# Altium schematic sheet ZynQ7xxx.SchDoc
size A1
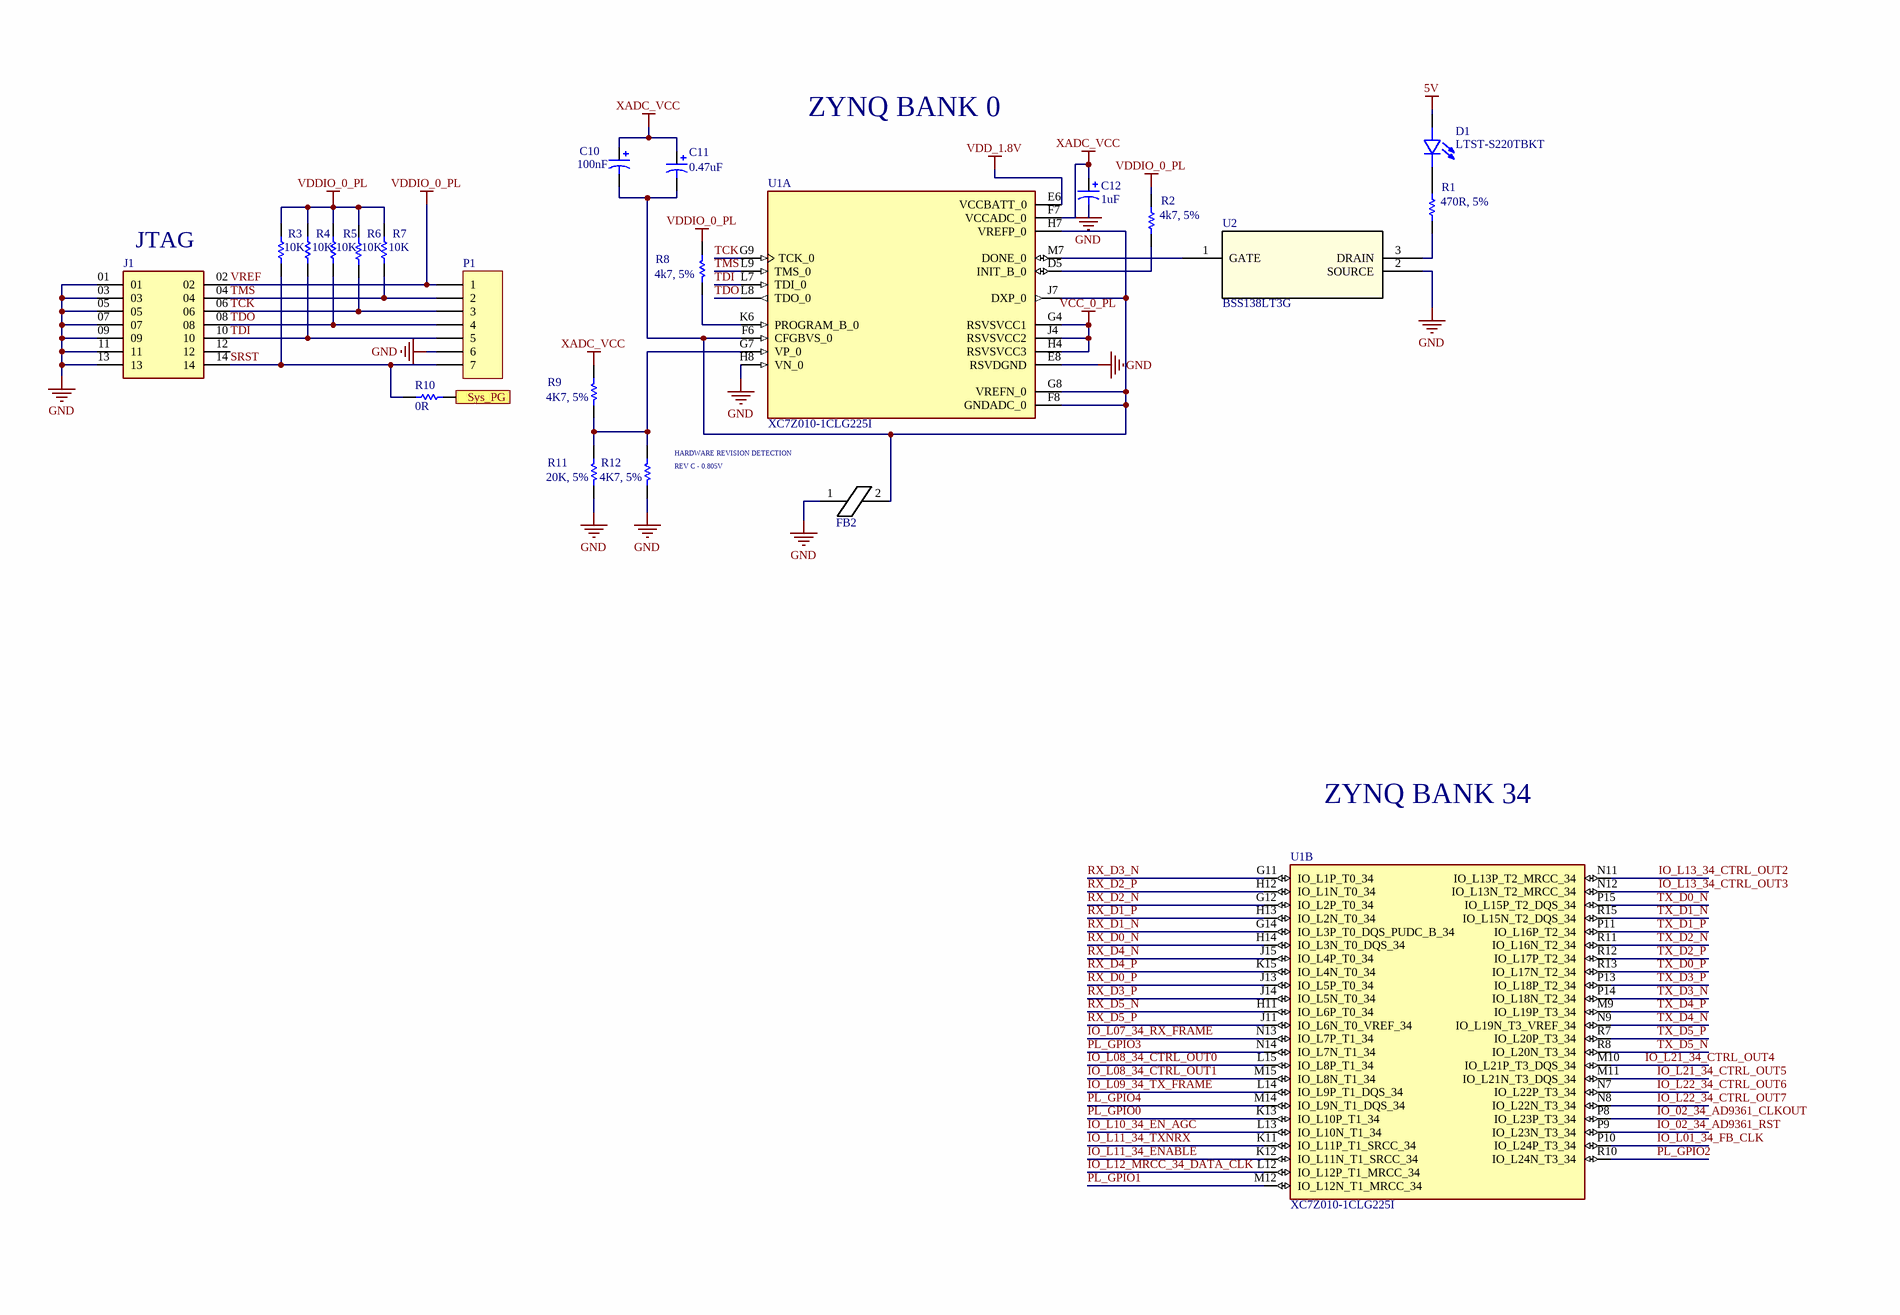
[diagram p0: ZynQ7xxx.SchDoc, top left]
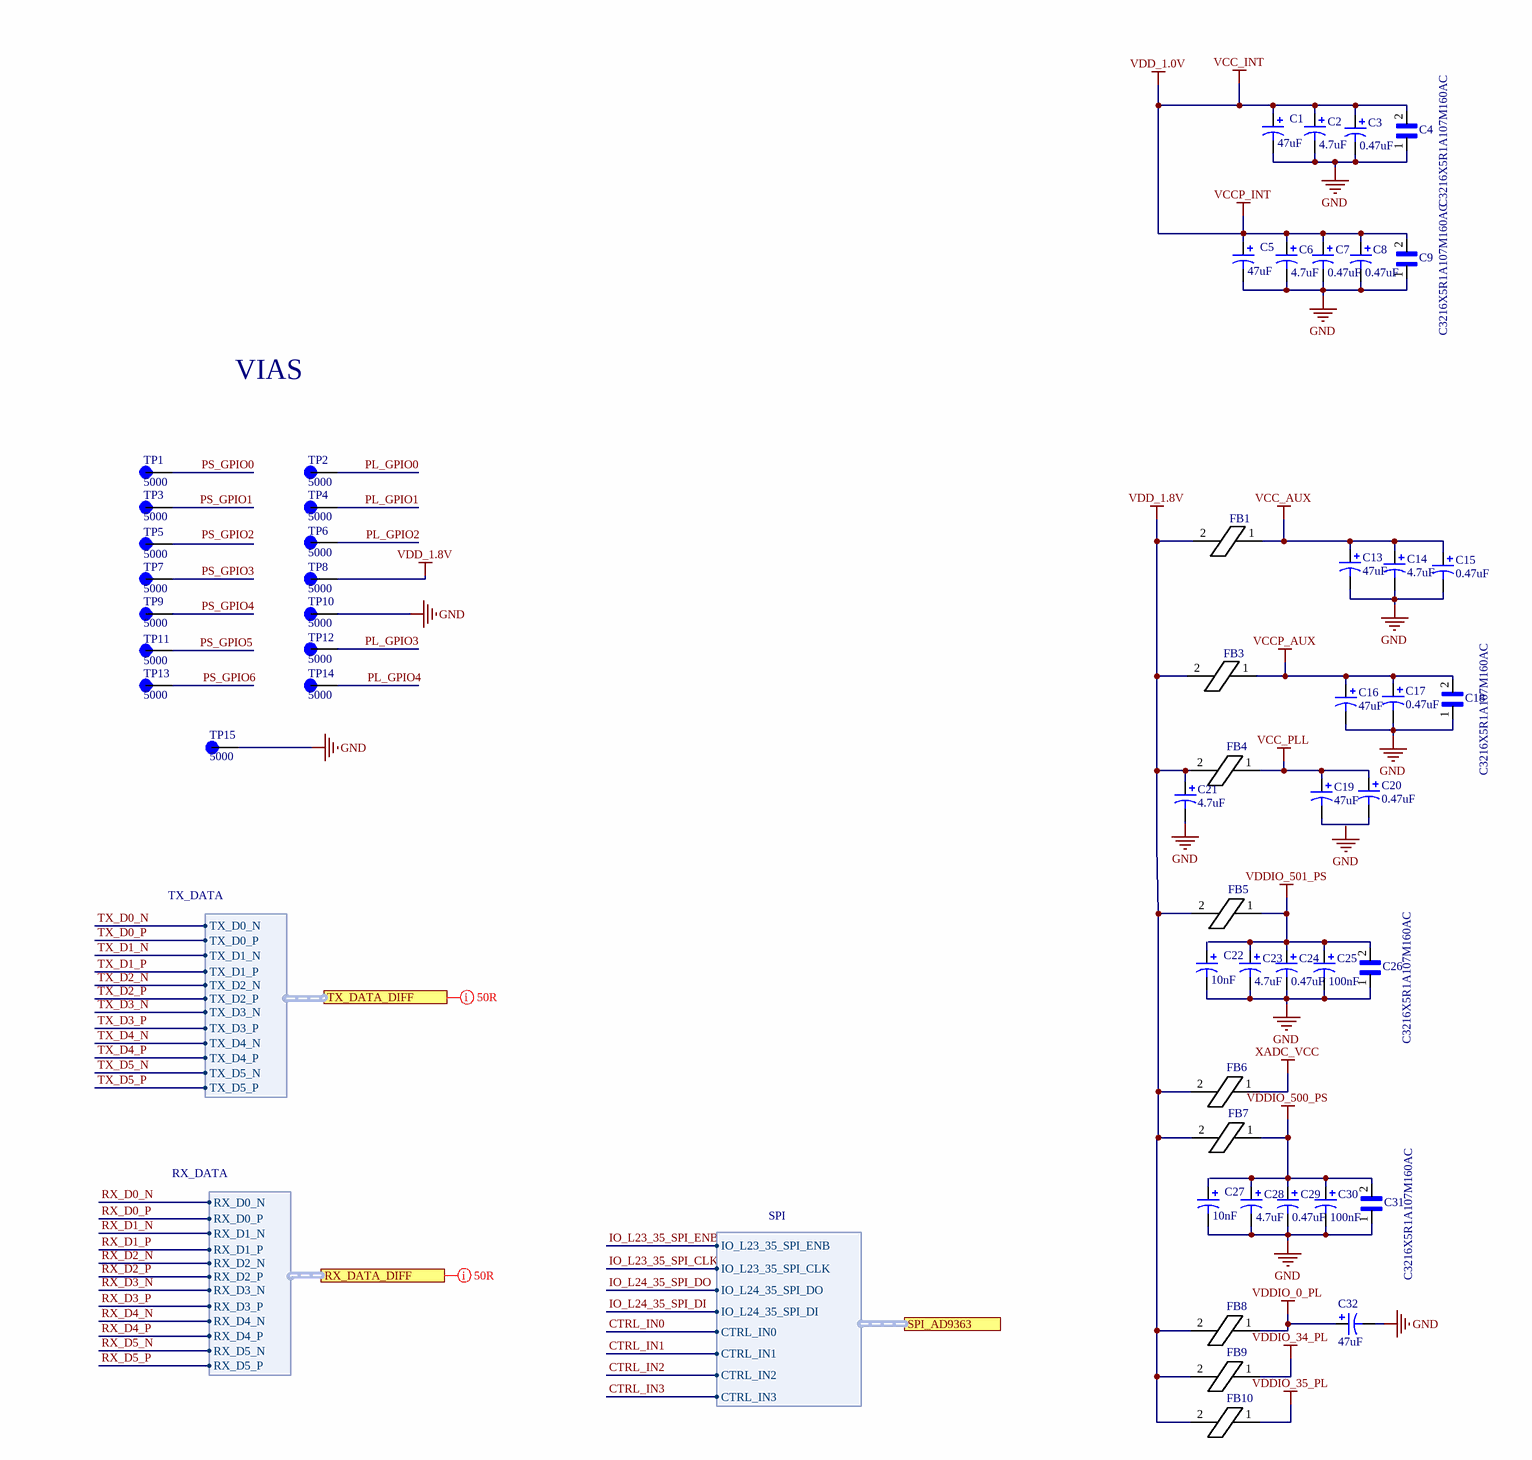
[diagram p1: ZynQ7xxx.SchDoc, top right]
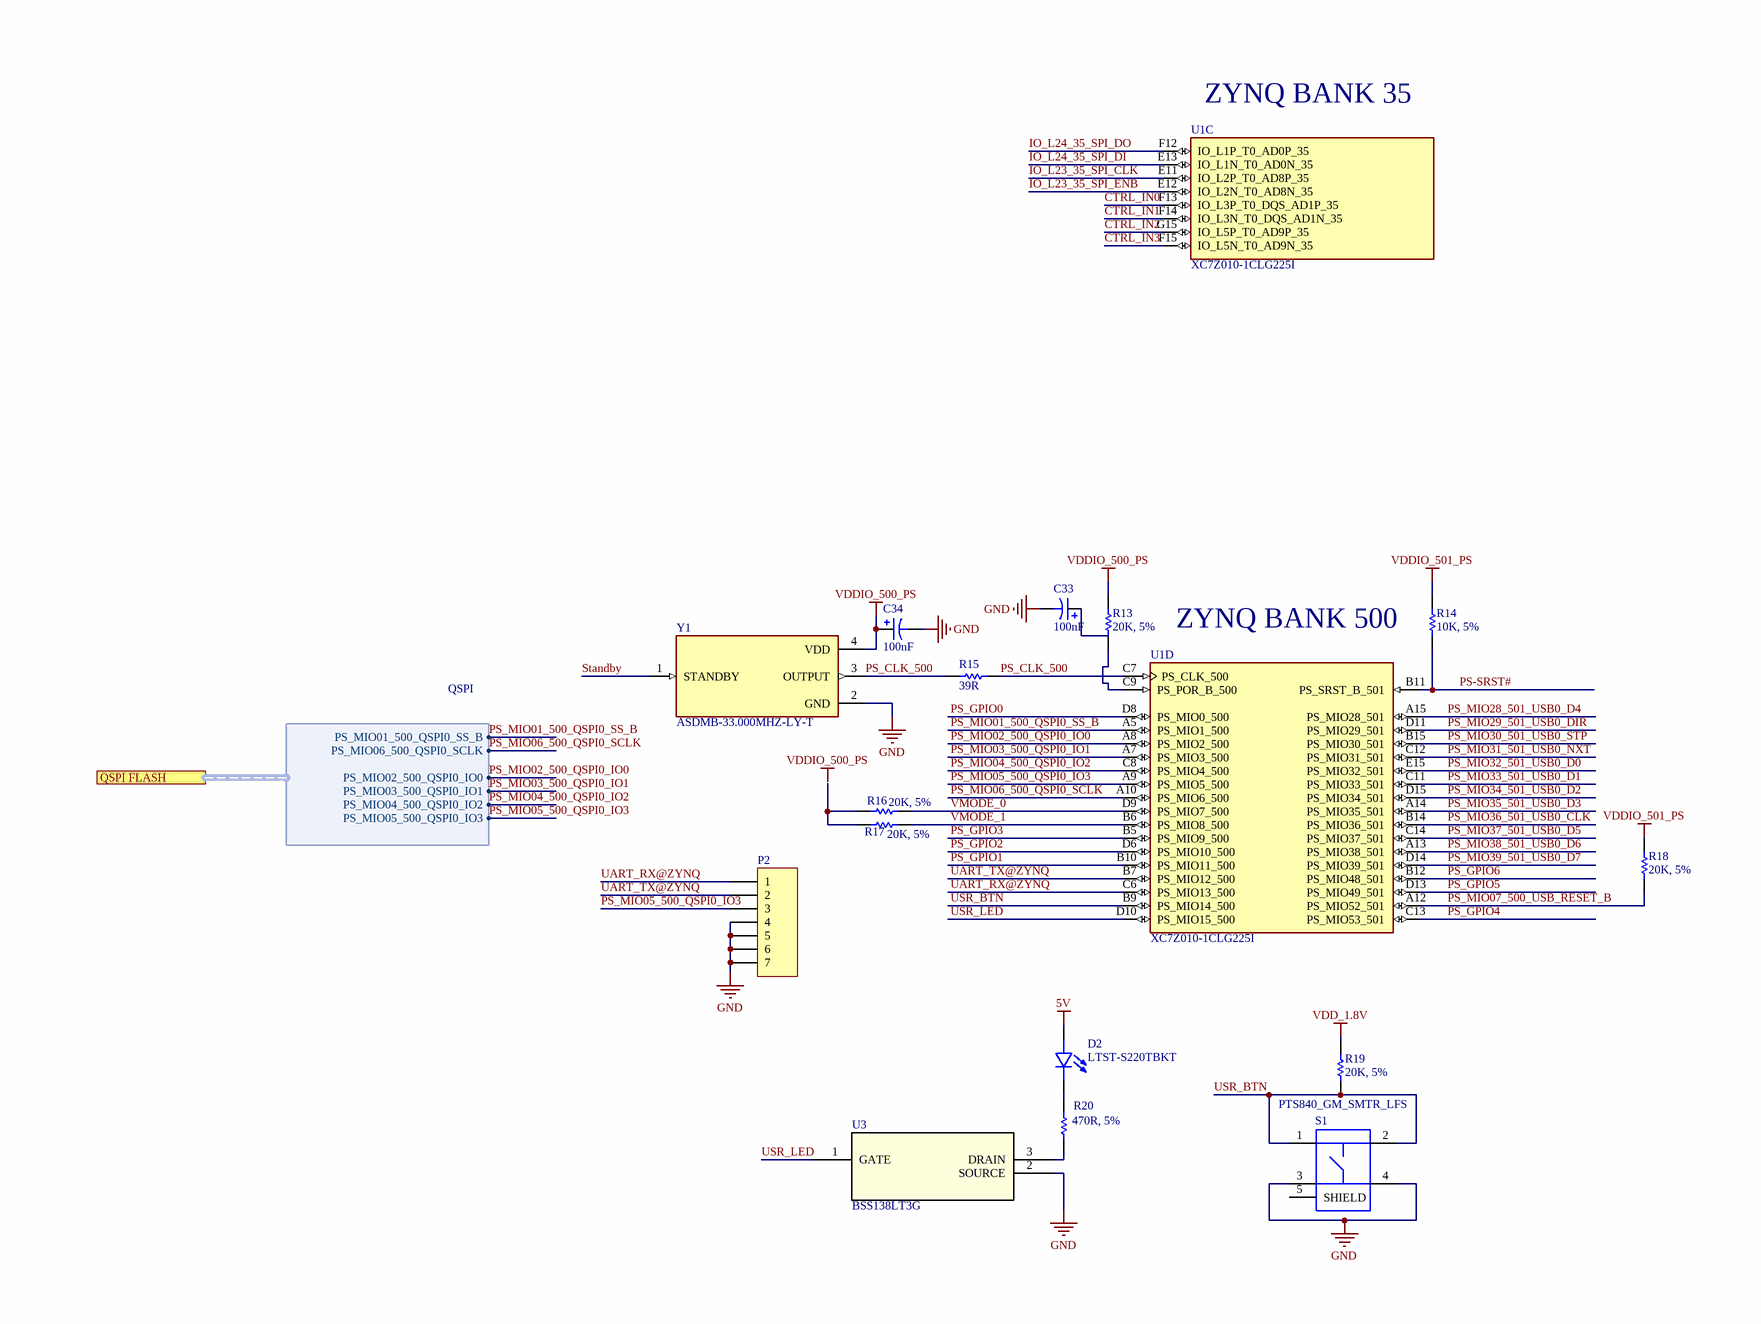
[diagram p2: ZynQ7xxx.SchDoc, bottom left]
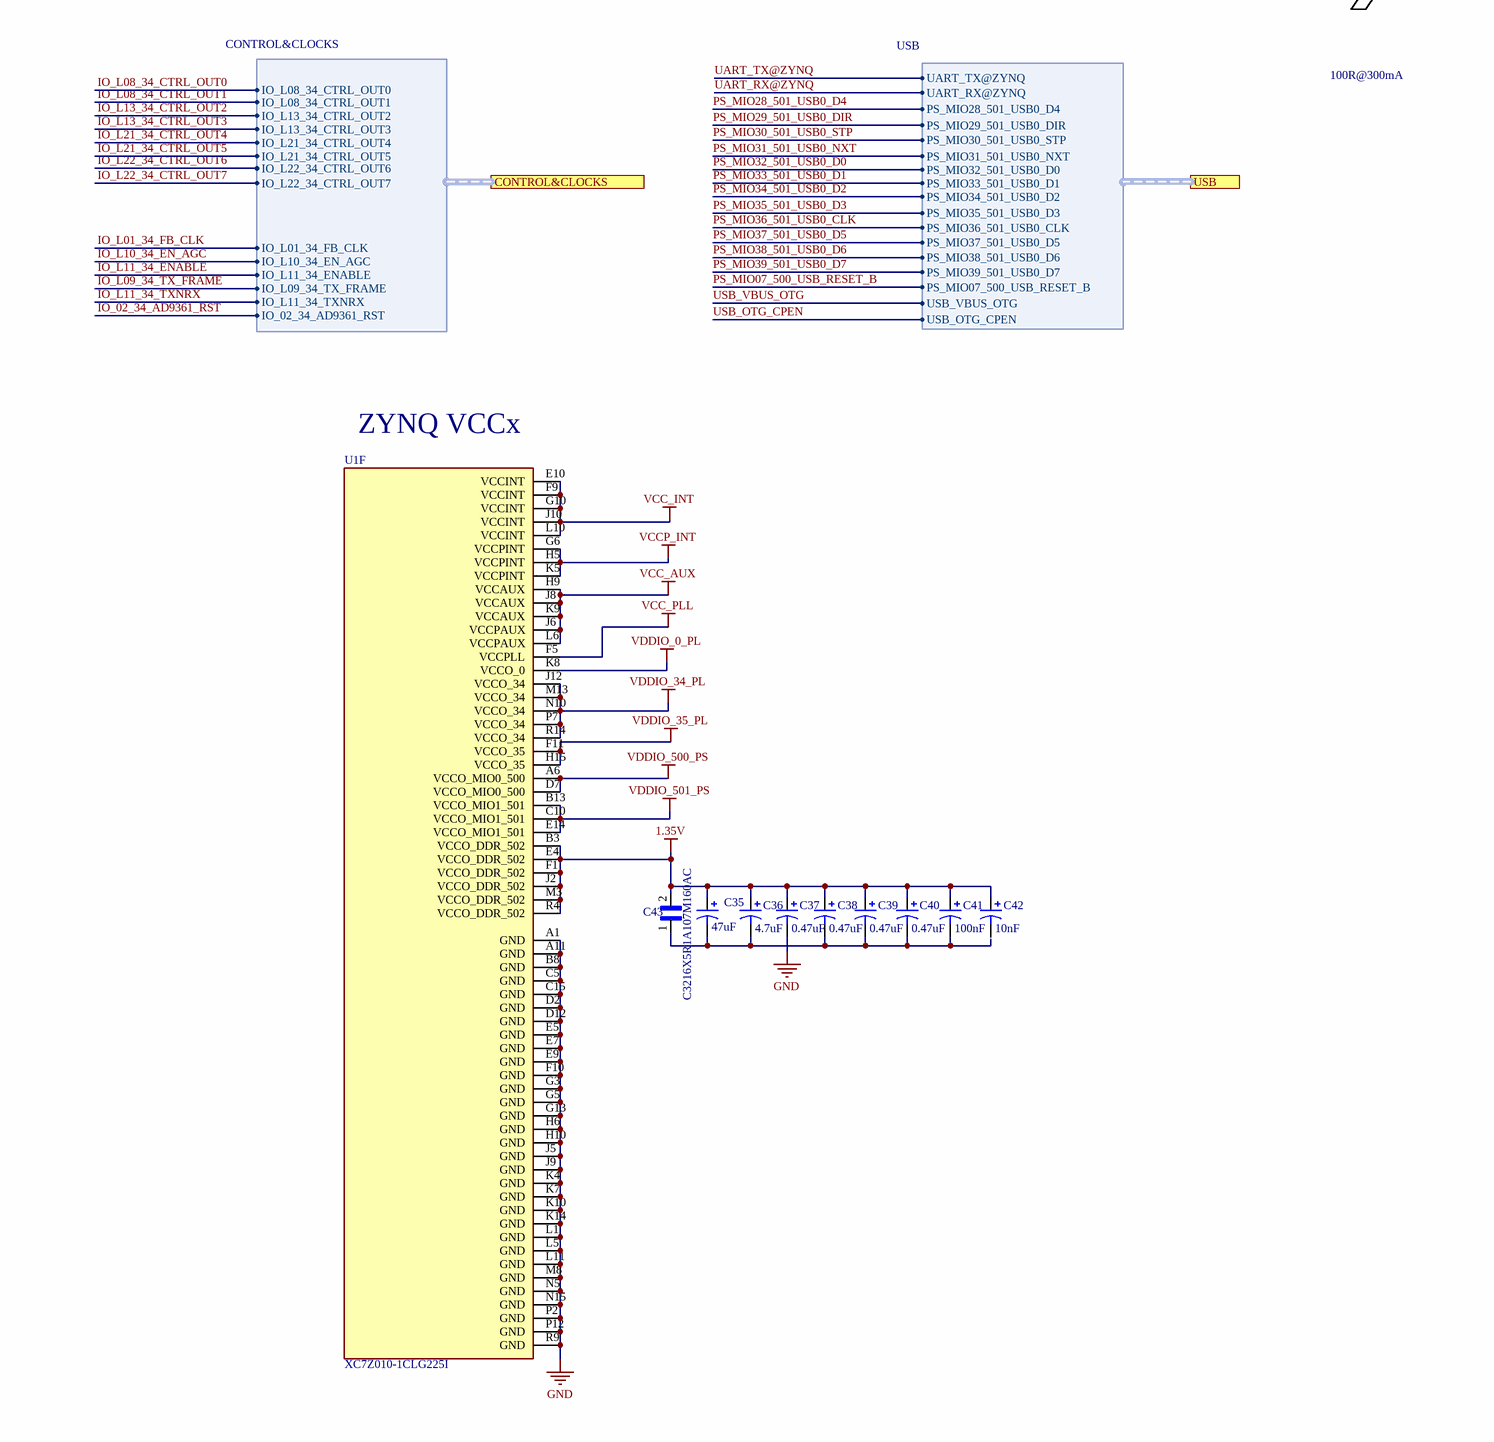
[diagram p3: ZynQ7xxx.SchDoc, bottom right]

## Parts
C1  value 47uF  [C0805]  (hidden comment: Cap Pol3)
C2  value 4.7uF  [C0805]  (hidden comment: Cap Pol3)
C3  value 0.47uF  [C0805]  (hidden comment: Cap Pol3)
C4  C3216X5R1A107M160AC  [CAPC3216X190N]
C5  value 47uF  [C0805]  (hidden comment: Cap Pol3)
C6  value 4.7uF  [C0805]  (hidden comment: Cap Pol3)
C7  value 0.47uF  [C0805]  (hidden comment: Cap Pol3)
C8  value 0.47uF  [C0805]  (hidden comment: Cap Pol3)
C9  C3216X5R1A107M160AC  [CAPC3216X190N]
C10  value 100nF  [C0805]  (hidden comment: Cap Pol3)
C11  value 0.47uF  [C0805]  (hidden comment: Cap Pol3)
C12  value 1uF  [C0805]  (hidden comment: Cap Pol3)
C13  value 47uF  [C0805]  (hidden comment: Cap Pol3)
C14  value 4.7uF  [C0805]  (hidden comment: Cap Pol3)
C15  value 0.47uF  [C0805]  (hidden comment: Cap Pol3)
C16  value 47uF  [C0805]  (hidden comment: Cap Pol3)
C17  value 0.47uF  [C0805]  (hidden comment: Cap Pol3)
C18  C3216X5R1A107M160AC  [CAPC3216X190N]
C19  value 47uF  [C0805]  (hidden comment: Cap Pol3)
C20  value 0.47uF  [C0805]  (hidden comment: Cap Pol3)
C21  value 4.7uF  [C0805]  (hidden comment: Cap Pol3)
C22  value 10nF  [C0805]  (hidden comment: Cap Pol3)
C23  value 4.7uF  [C0805]  (hidden comment: Cap Pol3)
C24  value 0.47uF  [C0805]  (hidden comment: Cap Pol3)
C25  value 100nF  [C0805]  (hidden comment: Cap Pol3)
C26  C3216X5R1A107M160AC  [CAPC3216X190N]
C27  value 10nF  [C0805]  (hidden comment: Cap Pol3)
C28  value 4.7uF  [C0805]  (hidden comment: Cap Pol3)
C29  value 0.47uF  [C0805]  (hidden comment: Cap Pol3)
C30  value 100nF  [C0805]  (hidden comment: Cap Pol3)
C31  C3216X5R1A107M160AC  [CAPC3216X190N]
C32  value 47uF  [C0805]  (hidden comment: Cap Pol3)
C33  value 100nF  [C0805]  (hidden comment: Cap Pol3)
C34  value 100nF  [C0805]  (hidden comment: Cap Pol3)
C35  value 47uF  [C0805]  (hidden comment: Cap Pol3)
C36  value 4.7uF  [C0805]  (hidden comment: Cap Pol3)
C37  value 0.47uF  [C0805]  (hidden comment: Cap Pol3)
C38  value 0.47uF  [C0805]  (hidden comment: Cap Pol3)
C39  value 0.47uF  [C0805]  (hidden comment: Cap Pol3)
C40  value 0.47uF  [C0805]  (hidden comment: Cap Pol3)
C41  value 100nF  [C0805]  (hidden comment: Cap Pol3)
C42  value 10nF  [C0805]  (hidden comment: Cap Pol3)
C43  C3216X5R1A107M160AC  [CAPC3216X190N]
D1  LTST-S220TBKT  [LED_LTST-S220TBKT]
D2  LTST-S220TBKT  [LED_LTST-S220TBKT]
FB1  FERRITA  [0805R]  (value not drawn)
FB2  FERRITA  [0805R]  (value not drawn)
FB3  FERRITA  [0805R]  (value not drawn)
FB4  FERRITA  [0805R]  (value not drawn)
FB5  FERRITA  [0805R]  (value not drawn)
FB6  FERRITA  [0805R]  (value not drawn)
FB7  FERRITA  [0805R]  (value not drawn)
FB8  FERRITA  [0805R]  (value not drawn)
FB9  FERRITA  [0805R]  (value not drawn)
FB10  FERRITA  [0805R]  (value not drawn)
J1  MTMM-107-03-G-D-190  [SAMTEC_MTMM-107-03-G-D-190]  (value not drawn)
P1  Header 7  [HDR1X7]  (value not drawn)
P2  Header 7  [HDR1X7]  (value not drawn)
R1  value 470R, 5%  [0603]  (hidden comment: Res1)
R2  value 4k7, 5%  [0603]  (hidden comment: Res1)
R3  value 10K  [0603]  (hidden comment: Res1)
R4  value 10K  [0603]  (hidden comment: Res1)
R5  value 10K  [0603]  (hidden comment: Res1)
R6  value 10K  [0603]  (hidden comment: Res1)
R7  value 10K  [0603]  (hidden comment: Res1)
R8  value 4k7, 5%  [0603]  (hidden comment: Res1)
R9  value 4K7, 5%  [0603]  (hidden comment: Res1)
R10  value 0R  [0603]  (hidden comment: Res1)
R11  value 20K, 5%  [0603]  (hidden comment: Res1)
R12  value 4K7, 5%  [0603]  (hidden comment: Res1)
R13  value 20K, 5%  [0603]  (hidden comment: Res1)
R14  value 10K, 5%  [0603]  (hidden comment: Res1)
R15  value 39R  [0603]  (hidden comment: Res1)
R16  value 20K, 5%  [0603]  (hidden comment: Res1)
R17  value 20K, 5%  [0603]  (hidden comment: Res1)
R18  value 20K, 5%  [0603]  (hidden comment: Res1)
R19  value 20K, 5%  [0603]  (hidden comment: Res1)
R20  value 470R, 5%  [0603]  (hidden comment: Res1)
S1  PTS840_GM_SMTR_LFS  [SW_PTS840GMSMTRLFS]
TP1  5000  [KEYSTONE_5000]
TP2  5000  [KEYSTONE_5000]
TP3  5000  [KEYSTONE_5000]
TP4  5000  [KEYSTONE_5000]
TP5  5000  [KEYSTONE_5000]
TP6  5000  [KEYSTONE_5000]
TP7  5000  [KEYSTONE_5000]
TP8  5000  [KEYSTONE_5000]
TP9  5000  [KEYSTONE_5000]
TP10  5000  [KEYSTONE_5000]
TP11  5000  [KEYSTONE_5000]
TP12  5000  [KEYSTONE_5000]
TP13  5000  [KEYSTONE_5000]
TP14  5000  [KEYSTONE_5000]
TP15  5000  [KEYSTONE_5000]
U1  XC7Z010-1CLG225I  [BGA225C80P15X15_1300X1300X150N]  (parts A,B,C,D,F of 6)
U2  BSS138LT3G  [SOT-23-3_1P4X3P040_ONS]
U3  BSS138LT3G  [SOT-23-3_1P4X3P040_ONS]
Y1  ASDMB-33.000MHZ-LY-T  [XTAL_ASDMB-33.000MHZ-LY-T]

## Ports
CONTROL&CLOCKS (harness CONTROL&CLOCKS), QSPI FLASH (harness QSPI), RX_DATA_DIFF (harness RX_DATA), SPI_AD9363 (harness SPI), Sys_PG, TX_DATA_DIFF (harness TX_DATA), USB (harness USB)

## Harnesses
TX_DATA: TX_D0_P, TX_D0_N, TX_D1_N, TX_D1_P, TX_D2_P, TX_D2_N, TX_D3_N, TX_D3_P, TX_D4_P, TX_D4_N, TX_D5_N, TX_D5_P
RX_DATA: RX_D0_P, RX_D0_N, RX_D1_N, RX_D1_P, RX_D2_P, RX_D2_N, RX_D3_N, RX_D3_P, RX_D4_P, RX_D5_N, RX_D5_P, RX_D4_N
SPI: IO_L24_35_SPI_DO, IO_L24_35_SPI_DI, IO_L23_35_SPI_CLK, IO_L23_35_SPI_ENB, CTRL_IN0, CTRL_IN1, CTRL_IN2, CTRL_IN3
CONTROL&CLOCKS: IO_L08_34_CTRL_OUT1, IO_L13_34_CTRL_OUT2, IO_L13_34_CTRL_OUT3, IO_L21_34_CTRL_OUT4, IO_L21_34_CTRL_OUT5, IO_L22_34_CTRL_OUT6, IO_L22_34_CTRL_OUT7, IO_L01_34_FB_CLK, IO_L10_34_EN_AGC, IO_L11_34_ENABLE, IO_L09_34_TX_FRAME, IO_L11_34_TXNRX, IO_02_34_AD9361_RST, IO_L08_34_CTRL_OUT0
QSPI: PS_MIO01_500_QSPI0_SS_B, PS_MIO06_500_QSPI0_SCLK, PS_MIO02_500_QSPI0_IO0, PS_MIO03_500_QSPI0_IO1, PS_MIO04_500_QSPI0_IO2, PS_MIO05_500_QSPI0_IO3
USB: PS_MIO29_501_USB0_DIR, PS_MIO28_501_USB0_D4, PS_MIO30_501_USB0_STP, PS_MIO31_501_USB0_NXT, PS_MIO33_501_USB0_D1, PS_MIO32_501_USB0_D0, PS_MIO34_501_USB0_D2, PS_MIO35_501_USB0_D3, PS_MIO37_501_USB0_D5, PS_MIO36_501_USB0_CLK, PS_MIO38_501_USB0_D6, PS_MIO39_501_USB0_D7, PS_MIO07_500_USB_RESET_B, USB_VBUS_OTG, USB_OTG_CPEN, UART_RX@ZYNQ, UART_TX@ZYNQ

## Nets
1.35V: C35.1 C36.1 C37.1 C38.1 C39.1 C40.1 C41.1 C42.1 C43.2 U1.B3(VCCO_DDR_502) U1.E4(VCCO_DDR_502) U1.F1(VCCO_DDR_502) U1.J2(VCCO_DDR_502) U1.M3(VCCO_DDR_502) U1.R4(VCCO_DDR_502)
5V: D1.A D2.A
GND: C1.2 C2.2 C3.2 C4.1 C5.2 C6.2 C7.2 C8.2 C9.1 C12.2 C13.2 C14.2 C15.2 C16.2 C17.2 C18.1 C21.2 C22.2 C23.2 C24.2 C25.2 C26.1 C27.2 C28.2 C29.2 C30.2 C31.1 C32.2 C33.2 C34.2 C37.2 FB2.1 J1.01 J1.03 J1.05 J1.07 J1.09 J1.11 J1.13 P1.6 P2.4 P2.5 P2.6 P2.7 R11.1 R12.1 S1.3 S1.4 TP10.TP TP15.TP U1.A1(GND) U1.A11(GND) U1.B8(GND) U1.C5(GND) U1.C15(GND) U1.D2(GND) U1.D12(GND) U1.E5(GND) U1.E7(GND) U1.E8(RSVDGND) U1.E9(GND) U1.F10(GND) U1.G3(GND) U1.G5(GND) U1.G13(GND) U1.H6(GND) U1.H8(VN_0) U1.H10(GND) U1.J5(GND) U1.J9(GND) U1.K4(GND) U1.K7(GND) U1.K10(GND) U1.K14(GND) U1.L1(GND) U1.L5(GND) U1.L11(GND) U1.M8(GND) U1.N5(GND) U1.N15(GND) U1.P2(GND) U1.P12(GND) U1.R9(GND) U2.2(SOURCE) U3.2(SOURCE) Y1.2(GND)
VCC_0_PL: U1.G4(RSVSVCC1) U1.H4(RSVSVCC3) U1.J4(RSVSVCC2)
VCC_AUX: C13.1 C14.1 C15.1 FB1.1 U1.H9(VCCAUX) U1.J6(VCCPAUX) U1.J8(VCCAUX) U1.K9(VCCAUX) U1.L6(VCCPAUX)
VCC_INT: C1.1 C2.1 C3.1 C4.2 C5.1 C6.1 C7.1 C8.1 C9.2 U1.E10(VCCINT) U1.F9(VCCINT) U1.G6(VCCPINT) U1.G10(VCCINT) U1.H5(VCCPINT) U1.J10(VCCINT) U1.K5(VCCPINT) U1.L10(VCCINT)  [also labelled VCCP_INT, VDD_1.0V]
VCC_PLL: C19.1 C20.1 FB4.1 U1.F5(VCCPLL)
VCCP_AUX: C16.1 C17.1 C18.2 FB3.1
VDD_1.8V: C21.1 FB1.2 FB3.2 FB4.2 FB5.2 FB6.2 FB7.2 FB8.2 FB9.2 FB10.2 R19.1 TP8.TP U1.E6(VCCBATT_0)
VDDIO_34_PL: FB9.1 U1.J12(VCCO_34) U1.M13(VCCO_34) U1.N10(VCCO_34) U1.P7(VCCO_34) U1.R14(VCCO_34)
VDDIO_35_PL: FB10.1 U1.F11(VCCO_35) U1.H15(VCCO_35)
VDDIO_500_PS: C28.1 C29.1 C30.1 C31.2 C34.1 FB7.1 R13.1 U1.A6(VCCO_MIO0_500) U1.D7(VCCO_MIO0_500) Y1.4(VDD)
VDDIO_501_PS: C23.1 C24.1 C25.1 C26.2 FB5.1 R14.1 R18.1 U1.B13(VCCO_MIO1_501) U1.C10(VCCO_MIO1_501) U1.E14(VCCO_MIO1_501)
VREF: C32.1 FB8.1 J1.02 P1.1 R2.2 R3.2 R4.2 R5.2 R6.2 R7.2 R8.2 U1.K8(VCCO_0)  [also labelled VDDIO_0_PL]
XADC_VCC: C10.1 C11.1 C12.1 FB6.1 R9.2 U1.F7(VCCADC_0)
CTRL_IN0: U1.F13(IO_L3P_T0_DQS_AD1P_35) ; port SPI_AD9363.CTRL_IN0
CTRL_IN1: U1.F14(IO_L3N_T0_DQS_AD1N_35) ; port SPI_AD9363.CTRL_IN1
CTRL_IN2: U1.G15(IO_L5P_T0_AD9P_35) ; port SPI_AD9363.CTRL_IN2
CTRL_IN3: U1.F15(IO_L5N_T0_AD9N_35) ; port SPI_AD9363.CTRL_IN3
IO_02_34_AD9361_CLKOUT: U1.P8(IO_L23P_T3_34)
IO_02_34_AD9361_RST: U1.P9(IO_L23N_T3_34) ; port CONTROL&CLOCKS.IO_02_34_AD9361_RST
IO_L01_34_FB_CLK: U1.P10(IO_L24P_T3_34) ; port CONTROL&CLOCKS.IO_L01_34_FB_CLK
IO_L07_34_RX_FRAME: U1.N13(IO_L7P_T1_34)
IO_L08_34_CTRL_OUT0: U1.L15(IO_L8P_T1_34) ; port CONTROL&CLOCKS.IO_L08_34_CTRL_OUT0
IO_L08_34_CTRL_OUT1: U1.M15(IO_L8N_T1_34) ; port CONTROL&CLOCKS.IO_L08_34_CTRL_OUT1
IO_L09_34_TX_FRAME: U1.L14(IO_L9P_T1_DQS_34) ; port CONTROL&CLOCKS.IO_L09_34_TX_FRAME
IO_L10_34_EN_AGC: U1.L13(IO_L10N_T1_34) ; port CONTROL&CLOCKS.IO_L10_34_EN_AGC
IO_L11_34_ENABLE: U1.K12(IO_L11N_T1_SRCC_34) ; port CONTROL&CLOCKS.IO_L11_34_ENABLE
IO_L11_34_TXNRX: U1.K11(IO_L11P_T1_SRCC_34) ; port CONTROL&CLOCKS.IO_L11_34_TXNRX
IO_L12_MRCC_34_DATA_CLK: U1.L12(IO_L12P_T1_MRCC_34)
IO_L13_34_CTRL_OUT2: U1.N11(IO_L13P_T2_MRCC_34) ; port CONTROL&CLOCKS.IO_L13_34_CTRL_OUT2
IO_L13_34_CTRL_OUT3: U1.N12(IO_L13N_T2_MRCC_34) ; port CONTROL&CLOCKS.IO_L13_34_CTRL_OUT3
IO_L21_34_CTRL_OUT4: U1.M10(IO_L21P_T3_DQS_34) ; port CONTROL&CLOCKS.IO_L21_34_CTRL_OUT4
IO_L21_34_CTRL_OUT5: U1.M11(IO_L21N_T3_DQS_34) ; port CONTROL&CLOCKS.IO_L21_34_CTRL_OUT5
IO_L22_34_CTRL_OUT6: U1.N7(IO_L22P_T3_34) ; port CONTROL&CLOCKS.IO_L22_34_CTRL_OUT6
IO_L22_34_CTRL_OUT7: U1.N8(IO_L22N_T3_34) ; port CONTROL&CLOCKS.IO_L22_34_CTRL_OUT7
IO_L23_35_SPI_CLK: U1.E11(IO_L2P_T0_AD8P_35) ; port SPI_AD9363.IO_L23_35_SPI_CLK
IO_L23_35_SPI_ENB: U1.E12(IO_L2N_T0_AD8N_35) ; port SPI_AD9363.IO_L23_35_SPI_ENB
IO_L24_35_SPI_DI: U1.E13(IO_L1N_T0_AD0N_35) ; port SPI_AD9363.IO_L24_35_SPI_DI
IO_L24_35_SPI_DO: U1.F12(IO_L1P_T0_AD0P_35) ; port SPI_AD9363.IO_L24_35_SPI_DO
PL_GPIO0: TP2.TP U1.K13(IO_L10P_T1_34)
PL_GPIO1: TP4.TP U1.M12(IO_L12N_T1_MRCC_34)
PL_GPIO2: TP6.TP U1.R10(IO_L24N_T3_34)
PL_GPIO3: TP12.TP U1.N14(IO_L7N_T1_34)
PL_GPIO4: TP14.TP U1.M14(IO_L9N_T1_DQS_34)
PS-SRST#: R14.2 U1.B11(PS_SRST_B_501)
PS_CLK_500: R15.1 R15.2 U1.C7(PS_CLK_500) Y1.3(OUTPUT)
PS_GPIO0: TP1.TP U1.D8(PS_MIO0_500)
PS_GPIO1: TP3.TP U1.B10(PS_MIO11_500)
PS_GPIO2: U1.D6(PS_MIO10_500)
PS_GPIO3: TP7.TP U1.B5(PS_MIO9_500)
PS_GPIO4: TP9.TP U1.C13(PS_MIO53_501)
PS_GPIO5: TP11.TP U1.D13(PS_MIO49_501)
PS_GPIO6: TP13.TP U1.B12(PS_MIO48_501)
PS_MIO01_500_QSPI0_SS_B: U1.A5(PS_MIO1_500) ; port QSPI FLASH.PS_MIO01_500_QSPI0_SS_B
PS_MIO02_500_QSPI0_IO0: U1.A8(PS_MIO2_500) ; port QSPI FLASH.PS_MIO02_500_QSPI0_IO0
PS_MIO03_500_QSPI0_IO1: U1.A7(PS_MIO3_500) ; port QSPI FLASH.PS_MIO03_500_QSPI0_IO1
PS_MIO04_500_QSPI0_IO2: U1.C8(PS_MIO4_500) ; port QSPI FLASH.PS_MIO04_500_QSPI0_IO2
PS_MIO05_500_QSPI0_IO3: P2.3 U1.A9(PS_MIO5_500) ; port QSPI FLASH.PS_MIO05_500_QSPI0_IO3
PS_MIO06_500_QSPI0_SCLK: U1.A10(PS_MIO6_500) ; port QSPI FLASH.PS_MIO06_500_QSPI0_SCLK
PS_MIO07_500_USB_RESET_B: R18.2 U1.A12(PS_MIO52_501) ; port USB.PS_MIO07_500_USB_RESET_B
PS_MIO28_501_USB0_D4: U1.A15(PS_MIO28_501) ; port USB.PS_MIO28_501_USB0_D4
PS_MIO29_501_USB0_DIR: U1.D11(PS_MIO29_501) ; port USB.PS_MIO29_501_USB0_DIR
PS_MIO30_501_USB0_STP: U1.B15(PS_MIO30_501) ; port USB.PS_MIO30_501_USB0_STP
PS_MIO31_501_USB0_NXT: U1.C12(PS_MIO31_501) ; port USB.PS_MIO31_501_USB0_NXT
PS_MIO32_501_USB0_D0: U1.E15(PS_MIO32_501) ; port USB.PS_MIO32_501_USB0_D0
PS_MIO33_501_USB0_D1: U1.C11(PS_MIO33_501) ; port USB.PS_MIO33_501_USB0_D1
PS_MIO34_501_USB0_D2: U1.D15(PS_MIO34_501) ; port USB.PS_MIO34_501_USB0_D2
PS_MIO35_501_USB0_D3: U1.A14(PS_MIO35_501) ; port USB.PS_MIO35_501_USB0_D3
PS_MIO36_501_USB0_CLK: U1.B14(PS_MIO36_501) ; port USB.PS_MIO36_501_USB0_CLK
PS_MIO37_501_USB0_D5: U1.C14(PS_MIO37_501) ; port USB.PS_MIO37_501_USB0_D5
PS_MIO38_501_USB0_D6: U1.A13(PS_MIO38_501) ; port USB.PS_MIO38_501_USB0_D6
PS_MIO39_501_USB0_D7: U1.D14(PS_MIO39_501) ; port USB.PS_MIO39_501_USB0_D7
RX_D0_N: U1.H14(IO_L3N_T0_DQS_34) ; port RX_DATA_DIFF.RX_D0_N
RX_D0_P: U1.J13(IO_L5P_T0_34) ; port RX_DATA_DIFF.RX_D0_P
RX_D1_N: U1.G14(IO_L3P_T0_DQS_PUDC_B_34) ; port RX_DATA_DIFF.RX_D1_N
RX_D1_P: U1.H13(IO_L2N_T0_34) ; port RX_DATA_DIFF.RX_D1_P
RX_D2_N: U1.G12(IO_L2P_T0_34) ; port RX_DATA_DIFF.RX_D2_N
RX_D2_P: U1.H12(IO_L1N_T0_34) ; port RX_DATA_DIFF.RX_D2_P
RX_D3_N: U1.G11(IO_L1P_T0_34) ; port RX_DATA_DIFF.RX_D3_N
RX_D3_P: U1.J14(IO_L5N_T0_34) ; port RX_DATA_DIFF.RX_D3_P
RX_D4_N: U1.J15(IO_L4P_T0_34) ; port RX_DATA_DIFF.RX_D4_N
RX_D4_P: U1.K15(IO_L4N_T0_34) ; port RX_DATA_DIFF.RX_D4_P
RX_D5_N: U1.H11(IO_L6P_T0_34) ; port RX_DATA_DIFF.RX_D5_N
RX_D5_P: U1.J11(IO_L6N_T0_VREF_34) ; port RX_DATA_DIFF.RX_D5_P
SRST: J1.14 P1.7 R3.1 R10.2
Standby: Y1.1(STANDBY)
Sys_PG: R10.1 ; port Sys_PG
TCK: J1.06 P1.3 R6.1 U1.G9(TCK_0)
TDI: J1.10 P1.5 R4.1 U1.L7(TDI_0)
TDO: J1.08 P1.4 R5.1 U1.L8(TDO_0)
TMS: J1.04 P1.2 R7.1 U1.L9(TMS_0)
TX_D0_N: U1.P15(IO_L15P_T2_DQS_34) ; port TX_DATA_DIFF.TX_D0_N
TX_D0_P: U1.R13(IO_L17N_T2_34) ; port TX_DATA_DIFF.TX_D0_P
TX_D1_N: U1.R15(IO_L15N_T2_DQS_34) ; port TX_DATA_DIFF.TX_D1_N
TX_D1_P: U1.P11(IO_L16P_T2_34) ; port TX_DATA_DIFF.TX_D1_P
TX_D2_N: U1.R11(IO_L16N_T2_34) ; port TX_DATA_DIFF.TX_D2_N
TX_D2_P: U1.R12(IO_L17P_T2_34) ; port TX_DATA_DIFF.TX_D2_P
TX_D3_N: U1.P14(IO_L18N_T2_34) ; port TX_DATA_DIFF.TX_D3_N
TX_D3_P: U1.P13(IO_L18P_T2_34) ; port TX_DATA_DIFF.TX_D3_P
TX_D4_N: U1.N9(IO_L19N_T3_VREF_34) ; port TX_DATA_DIFF.TX_D4_N
TX_D4_P: U1.M9(IO_L19P_T3_34) ; port TX_DATA_DIFF.TX_D4_P
TX_D5_N: U1.R8(IO_L20N_T3_34) ; port TX_DATA_DIFF.TX_D5_N
TX_D5_P: U1.R7(IO_L20P_T3_34) ; port TX_DATA_DIFF.TX_D5_P
UART_RX@ZYNQ: P2.1 U1.C6(PS_MIO13_500) ; port USB.UART_RX@ZYNQ
UART_TX@ZYNQ: P2.2 U1.B7(PS_MIO12_500) ; port USB.UART_TX@ZYNQ
USB_OTG_CPEN: port USB.USB_OTG_CPEN
USB_VBUS_OTG: port USB.USB_VBUS_OTG
USR_BTN: R19.2 S1.1 S1.2 U1.B9(PS_MIO14_500)
USR_LED: U1.D10(PS_MIO15_500) U3.1(GATE)
VMODE_0: R16.2 U1.D9(PS_MIO7_500)
VMODE_1: R17.2 U1.B6(PS_MIO8_500)
NetC10_2: C10.2 C11.2 FB2.2 U1.F6(CFGBVS_0) U1.F8(GNDADC_0) U1.G8(VREFN_0) U1.H7(VREFP_0) U1.J7(DXP_0)
NetC19_2: C19.2 C20.2
NetC35_2: C35.2 C36.2 C38.2 C39.2 C40.2 C41.2 C43.1
NetD1_C: D1.C R1.2
NetD2_C: D2.C R20.2
NetR1_1: R1.1 U2.3(DRAIN)
NetR2_1: R2.1 U1.D5(INIT_B_0)
NetR8_1: R8.1 U1.K6(PROGRAM_B_0)
NetR9_1: R9.1 R11.2 R12.2 U1.G7(VP_0)
NetR13_2: R13.2 U1.C9(PS_POR_B_500)
NetR16_1: R16.1 R17.1
NetR20_1: R20.1 U3.3(DRAIN)
NetU1_M7: U1.M7(DONE_0) U2.1(GATE)

Not connected (* = marked no-connect by the designer): C22 1; C27 1; C33 1; C42 2; J1 12; S1 5(SHIELD); TP5 TP

## Layout directives
mark named 50R: (no net found under the mark)

## Notes on the sheet
- ZYNQ BANK 0
- (near J1) JTAG
- VIAS
- (near R12) HARDWARE REVISION DETECTION
- (near R12) REV C - 0.805V
- ZYNQ BANK 34
- 100R@300mA
- (near U1) ZYNQ BANK 35
- ZYNQ VCCx
- (near U1) ZYNQ BANK 500
- Labels drawn without touching a wire or pin: GND, PS_GPIO2, VDDIO_500_PS

## Library data of the parts
C1-C3 C5-C8 C10-C17 C19-C25 C27-C30 C32-C42 = Cap Pol3: Polarized Capacitor (Surface Mount); Published: 8-Jun-2000; LatestRevisionDate: 29-May-2009; LatestRevisionNote: IPC-7351 Footprint Added.; PackageReference: C0805; Publisher: Altium Limited; PackageDescription: Chip Capacitor
C4 C9 C18 C26 C31 C43 = C3216X5R1A107M160AC: 100 ÂµF Â±20% 10V Ceramic Capacitor X5R 1206 (3216 Metric); MF: TDK; Package: 3216 TDK; Digi-Key_Part_Number: 445-6007-1-ND; Check_prices: https://www.snapeda.com/parts/C3216X5R1A107M160AC/TDK/view-part/?ref=eda; Value: *; MP: C3216X5R1A107M160AC; SnapEDA_Link: https://www.snapeda.com/parts/C3216X5R1A107M160AC/TDK/view-part/?ref=snap; Purchase-URL: https://pricing.snapeda.com/search/part/C3216X5R1A107M160AC/?ref=eda
P1 P2 = Header 7: Header, 7-Pin; LatestRevisionDate: 17-Jul-2002; LatestRevisionNote: Re-released for DXP Platform.; Publisher: Altium Limited
R1-R20 = Res1_1: Resistor; Manufacturer: Generic Components; Class I: Passive; Published: 8-Jun-2000; Revision: July-2002: Re-released for DXP Platform.; Publisher: Altium Limited; Class II: Resistor; REF FARNELL 1206 SMD 510R: 4387065; REF FARNELL 1206 SMD 1K: 912475; REF FARNELL 1206 SMD 10K: 912591; REF FARNELL 0603 SMD: 612-595
S1 = PTS840_GM_SMTR_LFS: Tactile Switch SPST-NO Side Actuated Surface Mount, Right Angle; MP: PTS840 GM SMTR LFS; MF: C&K; Price: None; SnapEDA_Link: https://www.snapeda.com/parts/PTS840%20GM%20SMTR%20LFS/C&K/view-part/628485/?ref=snap; Availability: Unavailable; Value: *; Package: None
TP1-TP15 = 5000: Test Point Miniature THM H .300 Nylon 46 Insulated Red PhosBronze/Silver | Keystone Electronics 5000; SnapEDA_Link: https://www.snapeda.com/parts/5000/Keystone/view-part/?ref=snap; Package: Test Point Keystone Electronics; Value: *; MF: Keystone Electronics; MP: 5000; Check_prices: https://www.snapeda.com/parts/5000/Keystone/view-part/?ref=eda
U1 = XC7Z010-1CLG225I: Dual ARMÂ® CortexÂ®-A9 MPCoreâ„¢ with CoreSightâ„¢ System On Chip _SOC_ IC ZynqÂ®-7000 Artixâ„¢-7 FPGA, 28K Logic Cells 667MHz 225-CSPBGA _13x13_; MF: Xilinx Inc.; Price: None; Availability: Unavailable; SnapEDA_Link: https://www.snapeda.com/parts/XC7Z010-1CLG225I/Xilinx%20Inc./view-part/1219501/?ref=snap; Value: *; Package: CSPBGA-225 Xilinx; MP: XC7Z010-1CLG225I
U2 U3 = BSS138LT3G: No Description Available; Mfr_Name: onsemi; RefDes: RefDes; Type: Type
D1 D2 = LTST-S220TBKT: Package: None; Price: None; Value: *; MP: LTST-S220TBKT; Availability: Unavailable
FB1-FB10 = FERRITA: CODIGO DIGIKEY: *; CODIGO FARNELL: *; CODIGO MOUSER: *; CODIGO PRODUCTO: *; DISTRIBUIDOR 1: *; DISTRIBUIDOR 2: *
J1 = MTMM-107-03-G-D-190: Price: None; Availability: Unavailable; MP: MTMM-107-03-G-D-190; Value: *; Package: None
Y1 = ASDMB-33.000MHZ-LY-T: Price: None; MP: ASDMB-33.000MHZ-LY-T; Availability: Unavailable; Value: *; Package: None